# EasyEDA schematic SCH_RTK2B Micro F9P Breakout Board_2023-11-26.json
TITLE: RTK2B Micro F9P Breakout Board; REV: 2.1; Date: 2023-11-26; Sheet: 1/1; Drawn By: wildbuckwheat; Company: AgOpenGPS
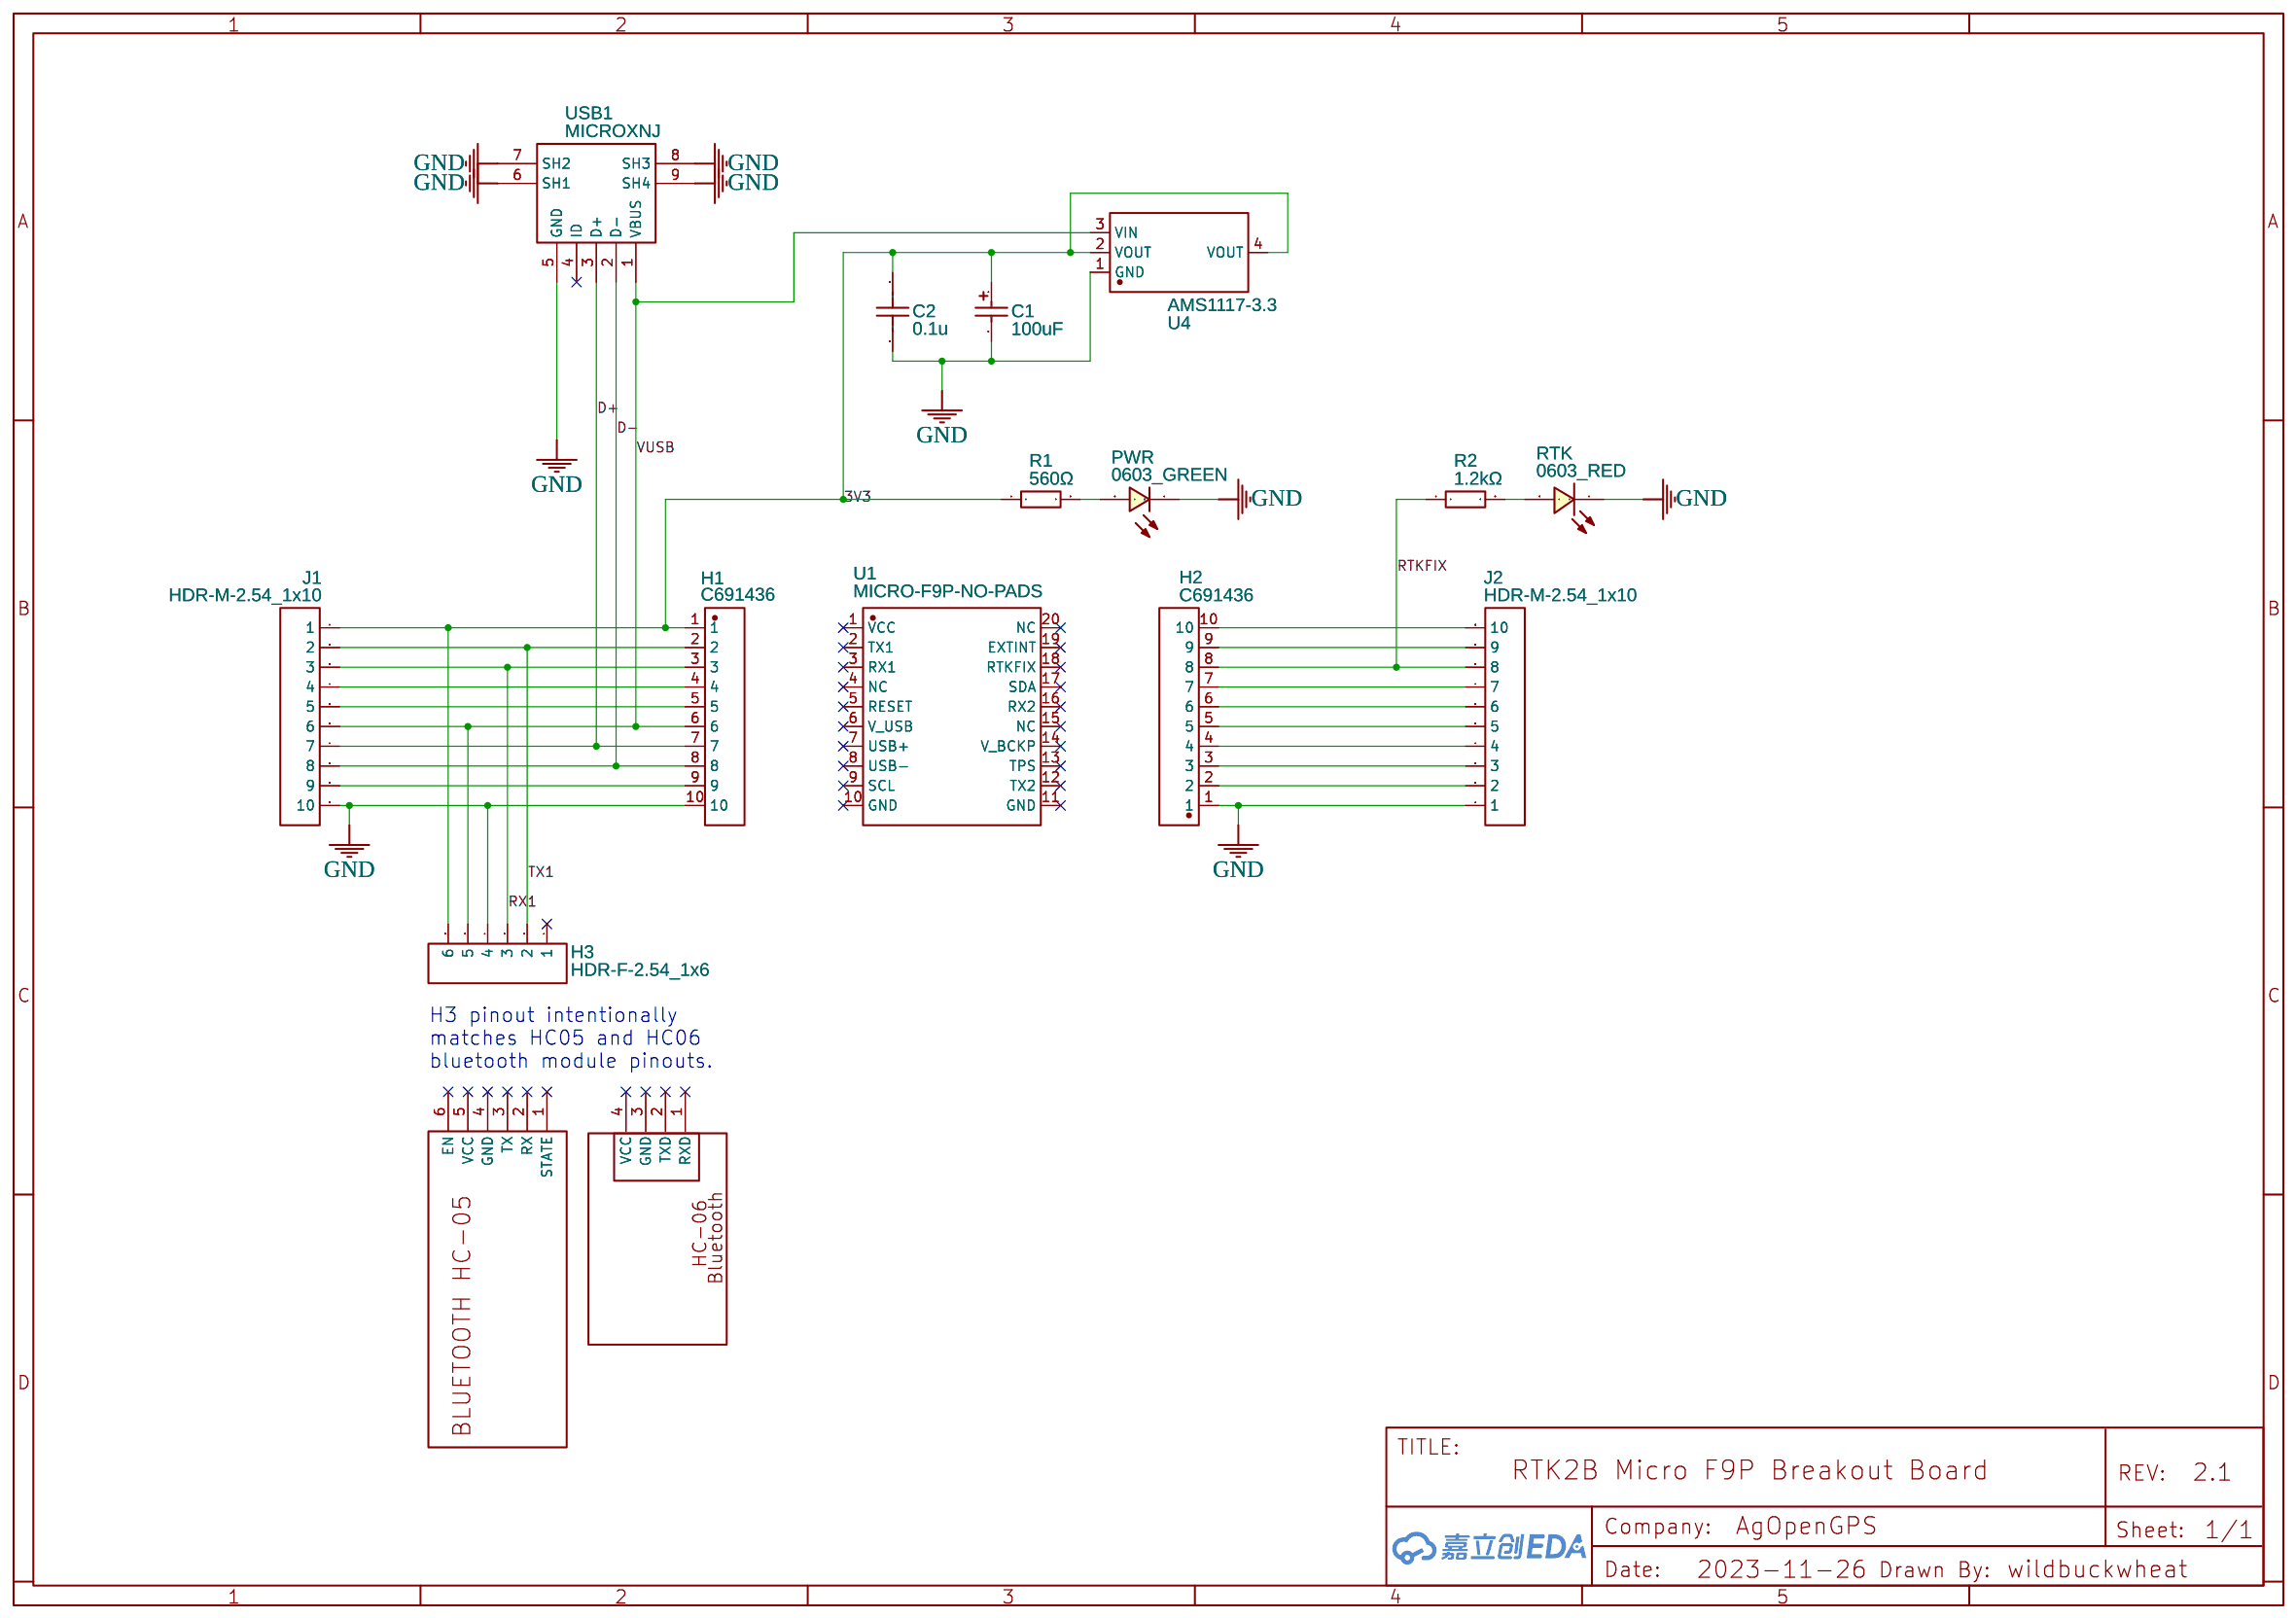
[diagram p0: schematic sheet]

## Parts
C1  100uF  [CAP-SMD_L3.5-W2.8]
C2  0.1u  [C0603]
H1  C691436  [HDR-TH_10P-P2.00-V-F]
H2  C691436  [HDR-TH_10P-P2.00-V-F]
H3  HDR-F-2.54_1x6  [HDR-F-2.54_1X6]
J1  HDR-M-2.54_1x10  [HDR-M-2.54_1X10]
J2  HDR-M-2.54_1x10  [HDR-M-2.54_1X10]
MK1  Modulo_Bluetooth_HC-06  [MODULO_BLUETOOTH_HC06]
PWR  0603_GREEN  [LED0603-RD]
R1  560Ω  [R0603]
R2  1.2kΩ  [R0603]
RTK  0603_RED  [LED0603-RD]
U1  MICRO-F9P-NO-PADS  [RTK2B-MICRO-F9P-NO-PADS]
U2  BLUETOOTH HC05 COPY  [HC05]
U4  AMS1117-3.3  [SOT-223-3_L6.5-W3.4-P2.30-LS7.0-BR]
USB1  MICROXNJ  [MICRO-USB-SMD_MICROXNJ]

## Library data of the parts
C1 = TAJB107K006RNJ: Supplier: LCSC; Manufacturer: Kyocera AVX; Supplier Part: C16133; JLCPCB Part Class: Basic Part
C2 = C_0603_US: Supplier Part: C14663; Contributor: LCEDA_Lib
H1 H2 = C691436: Supplier: LCSC; Manufacturer: BOOMELE(Boom Precision Elec); Contributor: LCSC; JLCPCB Part Class: Extended Part
H3 = HDR-F-2.54_1x6: Supplier Part: C40877; Supplier: LCSC; Contributor: LCEDA_Lib
J1 J2 = HDR-M-2.54_1x10: Supplier Part: C57369; Supplier: LCSC; Contributor: LCEDA_Lib
MK1 = Modulo_Bluetooth_HC-06: Contributor: PabloCevallos
PWR = 19-217/GHC-YR1S2/3T-GREEN: Supplier: LCSC; Manufacturer: EVERLIGHT(亿光); Manufacturer Part: 19-217/GHC-YR1S2/3T; Supplier Part: C72043; JLCPCB Part Class: Basic Part
R1 = 0603WAF5600T5E: Supplier: LCSC; Manufacturer: UNI-ROYAL(厚声); Supplier Part: C23204; JLCPCB Part Class: Basic Part; link: https://lcsc.com/eda_search?q=C23204&%26type=1&ref=editor
R2 = 0603WAF1201T5E: Supplier: LCSC; Manufacturer: UNI-ROYAL(厚声); Supplier Part: C22765; JLCPCB Part Class: Basic Part; link: https://lcsc.com/eda_search?q=C22765&%26type=1&ref=editor
RTK = KT-0603R-RED: Supplier: LCSC; Manufacturer: null; Manufacturer Part: KT-0603R; Supplier Part: C2286; JLCPCB Part Class: Basic Part
U1 = MICRO-F9P-NO-PADS: Contributor: wildbuckwheat
U2 = BLUETOOTH HC05 COPY: Manufacturer Part: BLUETOOTH HC05; Contributor: khya
U4 = AMS1117-3.3: sourceId: dwIGgezVh; Supplier: LCSC; Manufacturer: AMS; Supplier Part: C6186; JLCPCB Part Class: Basic Part
USB1 = MICROXNJ: Contributor: LCSC; Supplier: LCSC; Supplier Part: C404969; Manufacturer: SHOU HAN(首韩); Manufacturer Part: MicroXNJ; JLCPCB Part Class: Extended Part; link: https://lcsc.com/eda_search?q=C404969&%26type=1&ref=editor

## Nets
3V3: C1.1 C2.2 H1.1 H3.6 J1.1 R1.1 U4.2(VOUT) U4.4(VOUT)
GND: C1.2 C2.1 H1.10 H2.1 H3.4 J1.10 J2.1 PWR.1(C) RTK.1(K) U4.1(GND) USB1.5(GND) USB1.6(SH1) USB1.7(SH2) USB1.8(SH3) USB1.9(SH4)
D+: H1.7 J1.7 USB1.3(D+)
D-: H1.8 J1.8 USB1.2(D-)
RTKFIX: H2.8 J2.8 R2.1
RX1: H1.3 H3.3 J1.3
TX1: H1.2 H3.2 J1.2
VUSB: H1.6 H3.5 J1.6 U4.3(VIN) USB1.1(VBUS)
Net-(H1-4): H1.4 J1.4
Net-(H1-5): H1.5 J1.5
Net-(H1-9): H1.9 J1.9
Net-(H2-2): H2.2 J2.2
Net-(H2-3): H2.3 J2.3
Net-(H2-4): H2.4 J2.4
Net-(H2-5): H2.5 J2.5
Net-(H2-6): H2.6 J2.6
Net-(H2-7): H2.7 J2.7
Net-(H2-9): H2.9 J2.9
Net-(H2-10): H2.10 J2.10
Net-(PWR-2): PWR.2(A) R1.2
Net-(R2-2): R2.2 RTK.2(A)

Not connected (* = marked no-connect by the designer): H3 1*; MK1 1(RXD)* 2(TXD)* 3(GND)* 4(VCC)*; U1 1(VCC)* 2(TX1)* 3(RX1)* 4(NC)* 5(RESET)* 6(V_USB)* 7(USB+)* 8(USB-)* 9(SCL)* 10(GND)* 11(GND)* 12(TX2)* 13(TPS)* 14(V_BCKP)* 15(NC)* 16(RX2)* 17(SDA)* 18(RTKFIX)* 19(EXTINT)* 20(NC)*; U2 1(STATE)* 2(RX)* 3(TX)* 4(GND)* 5(VCC)* 6(EN)*; USB1 4(ID)*

## Notes on the sheet
- H3 pinout intentionally
  matches HC05 and HC06
  bluetooth module pinouts.
